# EAGLE design pest_repeller (EAGLE 9.0.1)
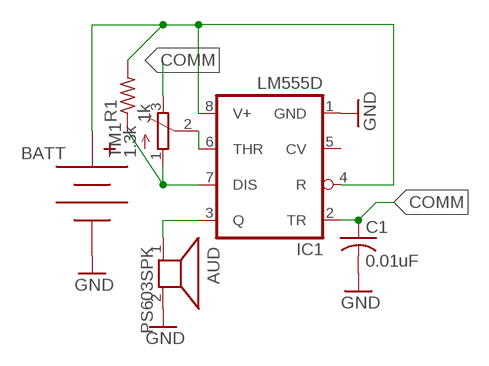
[diagram p0: schematic, sheet 1]

## Parts
AUD  PS603SPK  [PS603]
BATT  BC9VPC  [BC9VPC]
C1  0.01uF  C-USC0805  [C0805]
IC1  LM555D  [SO08]
R1  1k  R-US_R0805  [R0805]
TM1  1.3k  TRIMPOTTC33X  [TC33X]

## Nets
COMM: C1.1 IC1.2(TR) TM1.3(E)
GND: AUD.2 BATT.V- C1.2 IC1.1(GND)
N$1: BATT.V+ IC1.4(R) IC1.8(V+) R1.2
N$3: IC1.7(DIS) R1.1 TM1.1(A)
N$4: AUD.1 IC1.3(Q)
N$5: IC1.6(THR) TM1.2(S)
Unconnected: IC1.5(CV)

## Library data of the parts
AUD = adafruit:PS603: PS603 Small 8 ohm speaker, from Mouser. Can SMT solder to board http://www.ladyada.net/library/pcb/eaglelibrary.html; MPN: MCKPSP2950PN-16/0.25A-4763; OC_NEWARK: 25R0799
BATT = SparkFun-Connectors:BC9VPC: 9V Battery Holder - PC Mount Standard and Kit footprints included SparkFun Products: SparkFun SparkPunk Sound Kit <https://www.sparkfun.com/products/11177> SparkFun SparkPunk Sequencer Kit <https://www.sparkfun.com/products/12707>; MF: KEYSTONE ELECTR; MPN: 96; OC_NEWARK: 01J0072; PROD_ID: BATT-10855
C1 = adafruit:C-US: CAPACITOR, American symbol; MPN: C0805J103K3RACAUTO; OC_NEWARK: 02AC3534
IC1 = adafruit:*555: TIMER Changed DIP package to have round (not oval) pin pads http://www.ladyada.net/library/pcb/eaglelibrary.html; MPN: TLC555CP; OC_NEWARK: 24M8296
R1 = adafruit:R-US_: RESISTOR, American symbol; MF: BOURNS, INC.; MPN: CR0805-FX-1001ELF; OC_NEWARK: 32K2765
TM1 = adafruit:TRIMPOT: SMT trimmer potentiometer part number TC33X http://www.ladyada.net/library/eagle; MF: BOURNS, INC.; MPN: 3306F-1-103; OC_NEWARK: 04B2986

## Net classes
0 default: width 0.305 mm, drill 0.508 mm, clearance 0.254 mm

## Board
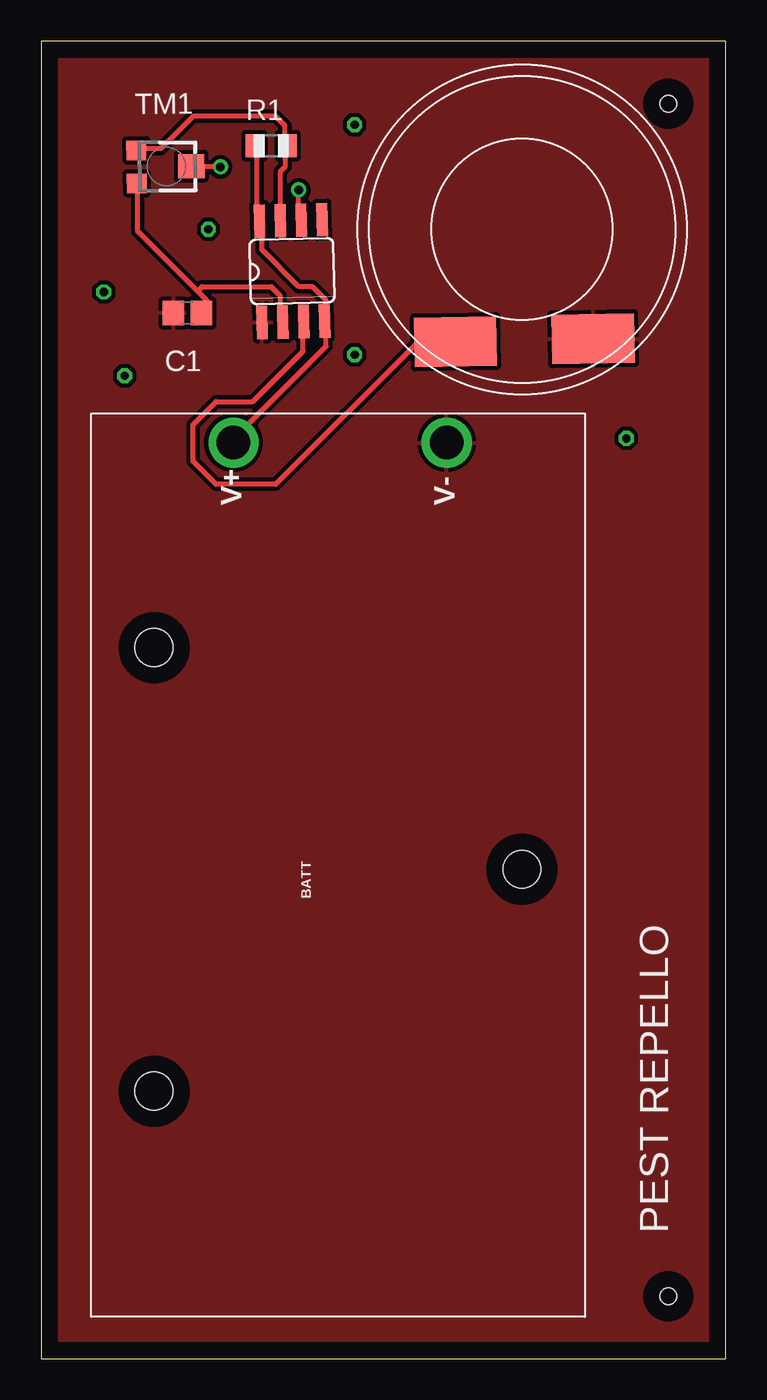
[diagram p1: board, top side]
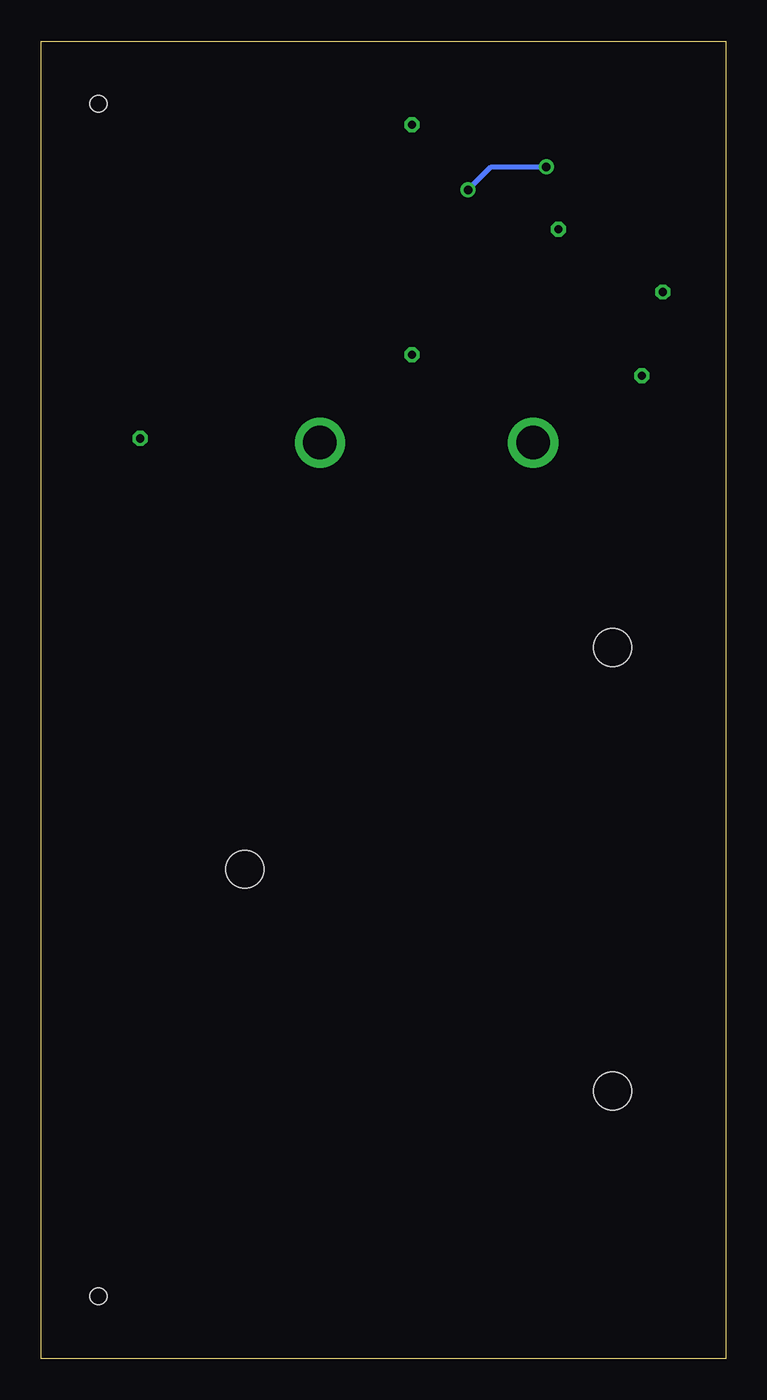
[diagram p2: board, bottom side, seen from below]

Size 41.58 x 80 mm. Coordinates in mm from the lower left corner, seen from the top.
Outline: 0,0 41.58,0 41.58,80 0,80 0,0
Copper layers (1*16): Top 0.035mm / dielectric 1.5mm / Bottom 0.035mm
Design rules "default *": minimum track width 122mil, minimum drill 20mil, track to track 6mil, track to pad 6mil, pad to pad 6mil, via to via 6mil, smd to smd 6mil, copper to edge 40mil, drill to drill 6mil, minimum pad ring 10mil, minimum via ring 8mil, stop-mask expansion 4mil, vias tented up to drill 0mil, thermal gap 10mil
Holes 1 mm at 38.1,3.81 38.1,76.2

### Footprints (pad centres in the part's own frame; a part is rotated, then mirrored left to right if it is on the bottom)
PS603 = smd 5 x 3: 1 -4.184,-6.738; 2 4.184,-6.738
BC9VPC = drill 2.032: V+ 53.086,21.336; V- 53.086,8.382 | hole 2.286: 27.178,3.81; 13.716,26.162; 40.64,26.162
C0805 = smd 1.3 x 1.5: 1 -0.85,0; 2 0.85,0
SO08 = smd 0.66 x 2.032: 1 -1.905,-3.073; 2 -0.635,-3.073; 3 0.635,-3.073; 4 1.905,-3.073; 5 1.905,3.073; 6 0.635,3.073; 7 -0.635,3.073; 8 -1.905,3.073
R0805 = smd 1.1 x 1.4: 1 -1,0; 2 1,0
TC33X = smd 1.2 x 1.2: 1 -1,-1.825; 3 1,-1.825 | smd 1.5 x 1.6: 2 0,1.5

### Placement (x,y rotation side)
AUD  29.21,68.58 1.2 top
BATT  33.02,2.54 90 top
C1  8.89,63.5 180 top
IC1  15.24,66.04 1.4 top
R1  13.97,73.66 180 top
TM1  7.62,72.39 270.6 top

### Tracks (layer width: path | path; a pad name or v marks a point on that pad's centre or on a via)
COMM
  Top 0.305: 9.5,64.82 10.06,64.26 10.06,63.98 9.78,63.7 C1.1 | 9.5,64.82 5.87,68.45 5.87,71.25 TM1.3 | 9.5,64.82 9.78,65.1 13.97,65.1 14.53,64.54 14.53,63.14 IC1.2
GND
  pour Top: -1.27,81.28 -1.27,-1.27 43.18,-1.27 43.18,81.28
  pour Top: -2.54,82.55 -2.54,-2.54 43.18,-2.54 43.18,81.28 43.18,82.55
N$1
  Top 0.305: R1.2 13.13,73.48 13.13,69.29 IC1.8 13.41,69.01 13.41,67.33 15.65,65.1 16.48,65.1 17.32,64.26 17.32,63.14 IC1.4 17.32,62.87 17.32,61.47 11.73,55.88 BATT.V+
N$2  (via drill 0.5)
  other vias: 3.81,64.77
N$3
  Top 0.305: TM1.1 5.87,73.48 7.26,73.48 9.22,75.44 14.25,75.44 14.81,74.88 14.81,73.76 R1.1 14.81,73.48 14.81,72.36 14.53,72.08 14.53,69.29 IC1.7
N$4
  Top 0.305: IC1.3 15.93,62.87 15.93,61.19 12.85,58.12 10.62,58.12 9.22,56.72 9.22,54.48 10.62,53.09 14.25,53.09 22.91,61.75 25.15,61.75 AUD.1
N$5  (via drill 0.51)
  Top 0.305: v10.9,72.36 9.22,72.36 TM1.2 | v15.65,70.97 15.65,69.29 IC1.6
  Bottom 0.305: v10.9,72.36 14.25,72.36 v15.65,70.97
N$6  (via drill 0.5)
  other vias: 35.56,55.88
N$7  (via drill 0.5)
  other vias: 19.05,74.93
N$8  (via drill 0.5)
  other vias: 19.05,60.96
N$9  (via drill 0.5)
  other vias: 10.16,68.58
N$10  (via drill 0.5)
  other vias: 5.08,59.69

### Text on the board
tNames: PEST REPELLO